# Altium schematic sheet Hall_Sensor_Board.SchDoc
size A4
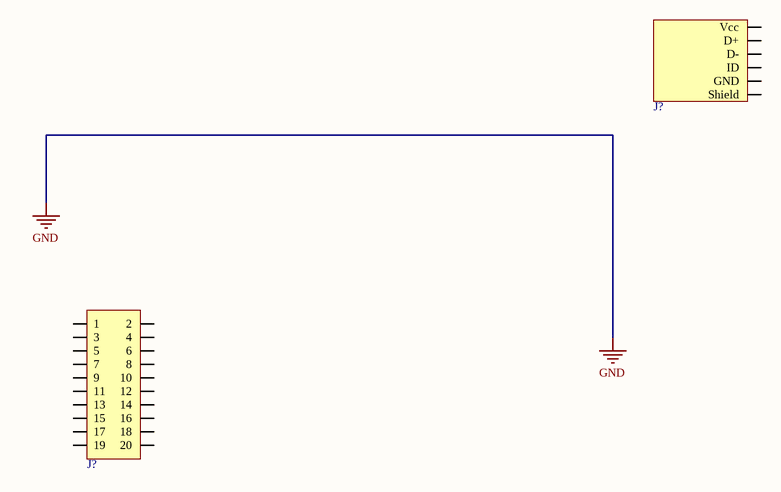
[diagram p0: Hall_Sensor_Board.SchDoc]

## Parts
(Parts that share a designator on the sheet are numbered #1, #2 ... from top to bottom, then left to right.)
J?#1  USB  [USB_mini]  (value not drawn)
J?#2  Header_20P  [SHDRV20W63P254_10X2_3302X914H881]  (value not drawn)

## Nets

Not connected (* = marked no-connect by the designer): J?#1 1(Vcc) 2(D-) 3(D+) 4(ID) 5(GND) 6(Shield); J?#2 1 2 3 4 5 6 7 8 9 10 11 12 13 14 15 16 17 18 19 20

## Library data of the parts
J?#1 = USB mini: Manufacturer Part Number: UJ2-MBH-1-SMT-TR; ComponentLinkDescription: Datasheet; FR_SN: J-03; Part Number: USB mini; Value: USB; ComponentLinkURL: https://hr.mouser.com/datasheet/2/670/uj2-mbh-smt-1313286.pdf; Supplier Part Number: 490-UJ2-MBH-1-SMT
J?#2 = Header_2x10_Shrouded: Manufacturer Part Number: 5103308-5; ComponentLinkDescription: Datasheet; FR_SN: J-06; Part Number: Header_2x10_Shrouded; Value: Header_20P; Supplier Part Number: 571-5103308-5